# EAGLE design OC2 (EAGLE 7.7.0)
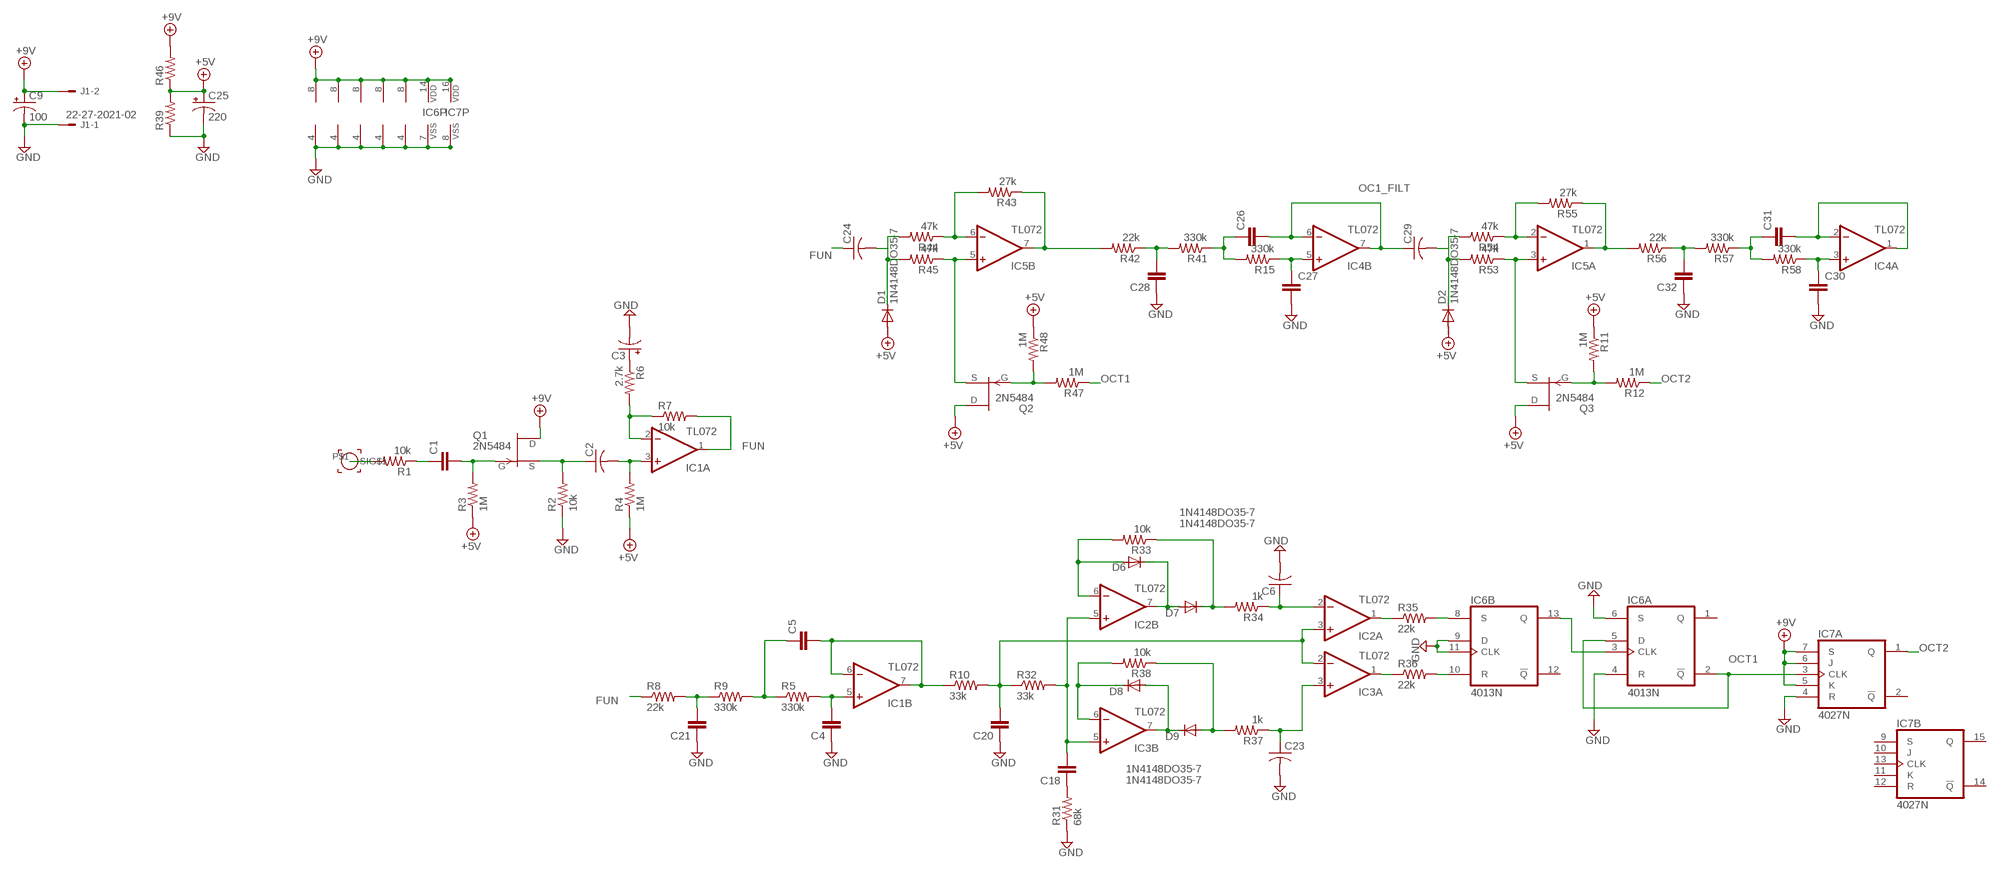
[diagram p0: schematic, sheet 1]

## Parts
C1  C-EU  [C025-025X050-BP]
C2  C-US  [C050-024X044-BP]
C3  CPOL-USE2.5-5  [E2,5-5]
C4  C-EU  [C025-025X050-BP]
C5  C-EU  [C025-025X050-BP]
C6  C-US  [C050-024X044-BP]
C9  100  CPOL-USE2.5-6  [E2,5-6]
C18  C-EU  [C025-025X050-BP]
C20  C-EU  [C025-025X050-BP]
C21  C-EU  [C025-025X050-BP]
C23  C-US  [C050-024X044-BP]
C24  C-US  [C050-024X044-BP]
C25  220  CPOL-USE3.5-8  [E3,5-8]
C26  C-EU  [C025-025X050-BP]
C27  C-EU  [C025-025X050-BP]
C28  C-EU  [C025-025X050-BP]
C29  C-US  [C050-024X044-BP]
C30  C-EU  [C025-025X050-BP]
C31  C-EU  [C025-025X050-BP]
C32  C-EU  [C025-025X050-BP]
D1  1N4148DO35-7  [DO35-7]
D2  1N4148DO35-7  [DO35-7]
D6  1N4148DO35-7  [DO35-7]
D7  1N4148DO35-7  [DO35-7]
D8  1N4148DO35-7  [DO35-7]
D9  1N4148DO35-7  [DO35-7]
IC1  TL072  [DIL08-BP]
IC2  TL072  [DIL08-BP]
IC3  TL072  [DIL08-BP]
IC4  TL072  [DIL08-BP]
IC5  TL072  [DIL08-BP]
IC6  4013N  [DIL14]
IC7  4027N  [DIL16]
INPUT  SIGNAL_PAD  [SIGNAL_PAD]
J1  22-27-2021-02  [6410-02]
Q1  2N5484  [TO92-]
Q2  2N5484  [TO92-]
Q3  2N5484  [TO92-]
R1  10k  R-US_  [0204V-BP]
R2  10k  R-US_  [0204V-BP]
R3  1M  R-US_  [0204V-BP]
R4  1M  R-US_  [0204V-BP]
R5  330k  R-US_  [0204V-BP]
R6  2.7k  R-US_  [0204V-BP]
R7  10k  R-US_  [0204V-BP]
R8  22k  R-US_0204/2V  [0204V]
R9  330k  R-US_0204/5  [0204/5]
R10  33k  R-US_  [0204V-BP]
R11  1M  R-US_  [0204V-BP]
R12  1M  R-US_  [0204V-BP]
R15  330k  R-US_  [0204V-BP]
R31  68k  R-US_  [0204V-BP]
R32  33k  R-US_  [0204V-BP]
R33  10k  R-US_  [0204V-BP]
R34  1k  R-US_  [0204V-BP]
R35  22k  R-US_  [0204V-BP]
R36  22k  R-US_0204/5  [0204/5]
R37  1k  R-US_  [0204V-BP]
R38  10k  R-US_  [0204V-BP]
R39  R-US_  [0204V-BP]
R41  330k  R-US_  [0204V-BP]
R42  22k  R-US_  [0204V-BP]
R43  27k  R-US_  [0204V-BP]
R44  47k  R-US_  [0204V-BP]
R45  47k  R-US_  [0204V-BP]
R46  R-US_  [0204V-BP]
R47  1M  R-US_  [0204V-BP]
R48  1M  R-US_  [0204V-BP]
R53  47k  R-US_  [0204V-BP]
R54  47k  R-US_  [0204V-BP]
R55  27k  R-US_  [0204V-BP]
R56  22k  R-US_  [0204V-BP]
R57  330k  R-US_  [0204V-BP]
R58  330k  R-US_  [0204V-BP]

## Nets
+5V: C25.+ D1.A D2.A Q2.3(D) Q3.3(D) R3.1 R4.1 R11.1 R39.2 R46.1 R48.1
+9V: C9.+ IC1.8(P:V+) IC2.8(P:V+) IC3.8(P:V+) IC4.8(P:V+) IC5.8(P:V+) IC6.14(P:VDD) IC7.5(A:K) IC7.6(A:J) IC7.7(A:S) IC7.16(P:VDD) J1.2 Q1.3(D) R46.2
FUN: C24.1 IC1.1(A:OUT) R7.2 R8.1
GND: C3.- C4.1 C6.2 C9.- C20.1 C21.1 C23.2 C25.- C27.2 C28.1 C30.2 C32.1 IC1.4(P:V-) IC2.4(P:V-) IC3.4(P:V-) IC4.4(P:V-) IC5.4(P:V-) IC6.4(A:R) IC6.6(A:S) IC6.7(P:VSS) IC6.9(B:D) IC6.11(B:CLK) IC7.4(A:R) IC7.8(P:VSS) J1.1 R2.1 R31.1 R39.1
N$1: IC1.2(A:-IN) R6.2 R7.1
N$2: C3.+ R6.1
N$3: Q2.1(G) R47.2 R48.2
N$4: C2.1 Q1.2(S) R2.2
N$5: C2.2 IC1.3(A:+IN) R4.2
N$6: IC6.8(B:S) R35.2
N$7: IC2.1(A:OUT) R35.1
N$8: IC3.1(A:OUT) R36.1
N$9: IC6.10(B:R) R36.2
N$10: INPUT.P$1(SIG$1) R1.2
N$11: IC6.3(A:CLK) IC6.13(B:Q)
N$12: IC5.5(B:+IN) Q2.2(S) R45.1
N$13: C1.1 R1.1
N$14: C1.2 Q1.1(G) R3.2
N$15: C21.2 R8.2 R9.1
N$16: C5.1 R5.1 R9.2
N$17: C4.2 IC1.5(B:+IN) R5.2
N$18: C5.2 IC1.6(B:-IN) IC1.7(B:OUT) R10.1
N$19: C20.2 IC2.3(A:+IN) IC3.2(A:-IN) R10.2 R32.1
N$20: C18.2 IC2.5(B:+IN) IC3.5(B:+IN) R32.2
N$21: C18.1 R31.2
N$22: D8.C IC3.6(B:-IN) R38.2
N$23: D8.A D9.C IC3.7(B:OUT)
N$24: D6.C D7.A IC2.7(B:OUT)
N$25: D6.A IC2.6(B:-IN) R33.2
N$26: C6.1 IC2.2(A:-IN) R34.1
N$27: D9.A R37.2 R38.1
N$28: C23.1 IC3.3(A:+IN) R37.1
N$29: D7.C R33.1 R34.2
N$30: Q3.1(G) R11.2 R12.2
N$31: IC5.3(A:+IN) Q3.2(S) R53.1
N$32: C24.2 D1.C R44.2 R45.2
N$33: C29.2 D2.C R53.2 R54.2
N$34: IC5.6(B:-IN) R43.2 R44.1
N$35: IC5.2(A:-IN) R54.1 R55.2
N$37: IC5.1(A:OUT) R55.1 R56.2
N$38: IC5.7(B:OUT) R42.2 R43.1
N$39: C30.1 IC4.3(A:+IN) R58.1
N$40: C27.1 IC4.5(B:+IN) R15.1
N$41: C26.1 R15.2 R41.1
N$42: C28.2 R41.2 R42.1
N$43: C31.1 R57.1 R58.2
N$44: C32.2 R56.1 R57.2
OC1_FILT: C26.2 C29.1 IC4.6(B:-IN) IC4.7(B:OUT)
OC1_FILT2: C31.2 IC4.1(A:OUT) IC4.2(A:-IN)
OCT1: IC6.2(A:!Q) IC6.5(A:D) IC7.3(A:CLK) R47.1
OCT2: IC7.1(A:Q) R12.1
Unconnected: IC6.1(A:Q) IC6.12(B:!Q) IC7.2(A:!Q) IC7.9(B:S) IC7.10(B:J) IC7.11(B:K) IC7.12(B:R) IC7.13(B:CLK) IC7.14(B:!Q) IC7.15(B:Q)

## Library data of the parts
C1 C4 C5 C18 C20 C21 C26-C28 C30-C32 = rcl:C-EU: CAPACITOR, European symbol
C2 C6 C23 C24 C29 = rcl:C-US: CAPACITOR, American symbol
C3 C9 C25 = rcl:CPOL-US: POLARIZED CAPACITOR, American symbol
D1 D2 D6-D9 = diode:1N4148: DIODE high speed (Philips)
IC1-IC5 = linear:TL072: OP AMP
IC6 = 40xx:4013: Dual D FLIP FLOP, set/reset
IC7 = 40xx:4027: Dual JK FLIP FLOP
INPUT = SignalPad:SIGNAL_PAD
J1 = con-molex:22-?-02: CONNECTOR wire to board 2.54 mm (.1 inch) pitch header; OC_FARNELL: unknown; OC_NEWARK: unknown
Q1-Q3 = transistor-fet:?548*: N-Channel JFETs Source: VISHAY 2N5484.pdf Compatible: TO92 2N5245 J304 J305 U310 J308 J309 J310 TO72 2N4416 2N4416A 2N3823 2N4351 3N169 3N170 3N171 MFE3002 TO18 2N3796 2N3797 MFE825 Source: Motorola European Master Guide Pacge 3-59
R1-R12 R15 R31-R39 R41-R48 R53-R58 = rcl:R-US_: RESISTOR, American symbol

## Board
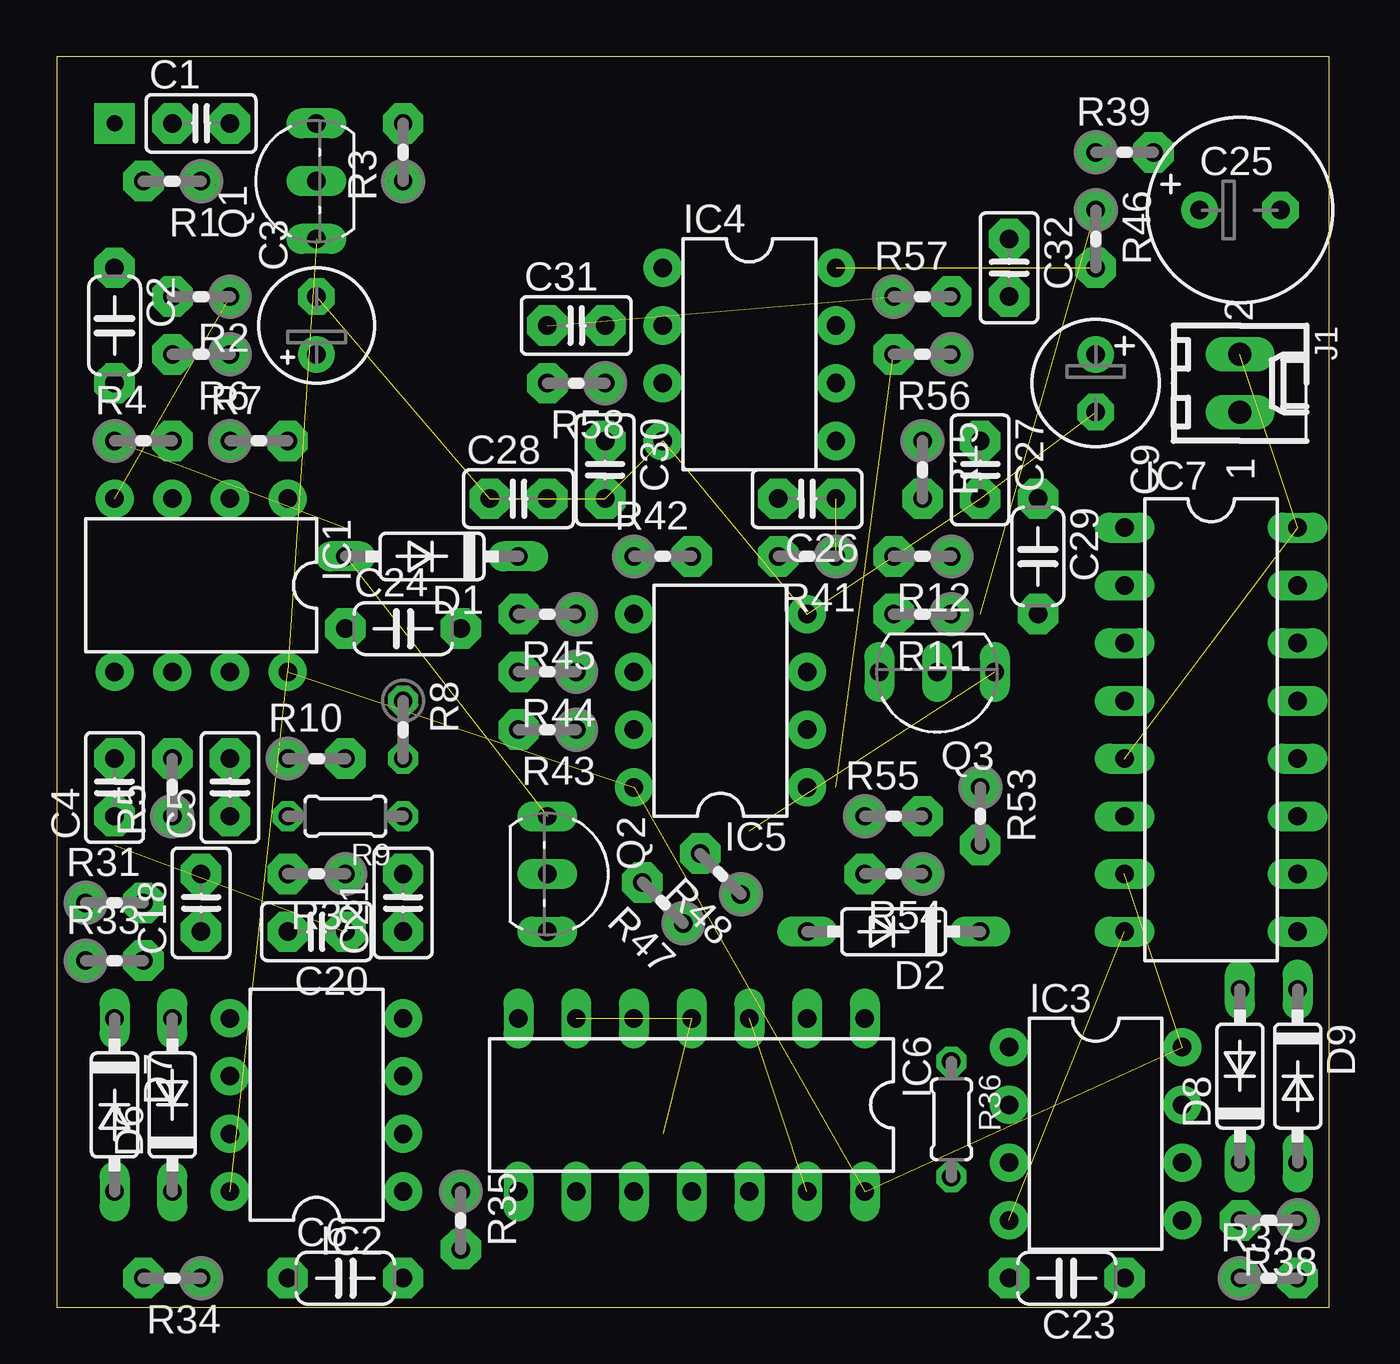
[diagram p1: board, top side]
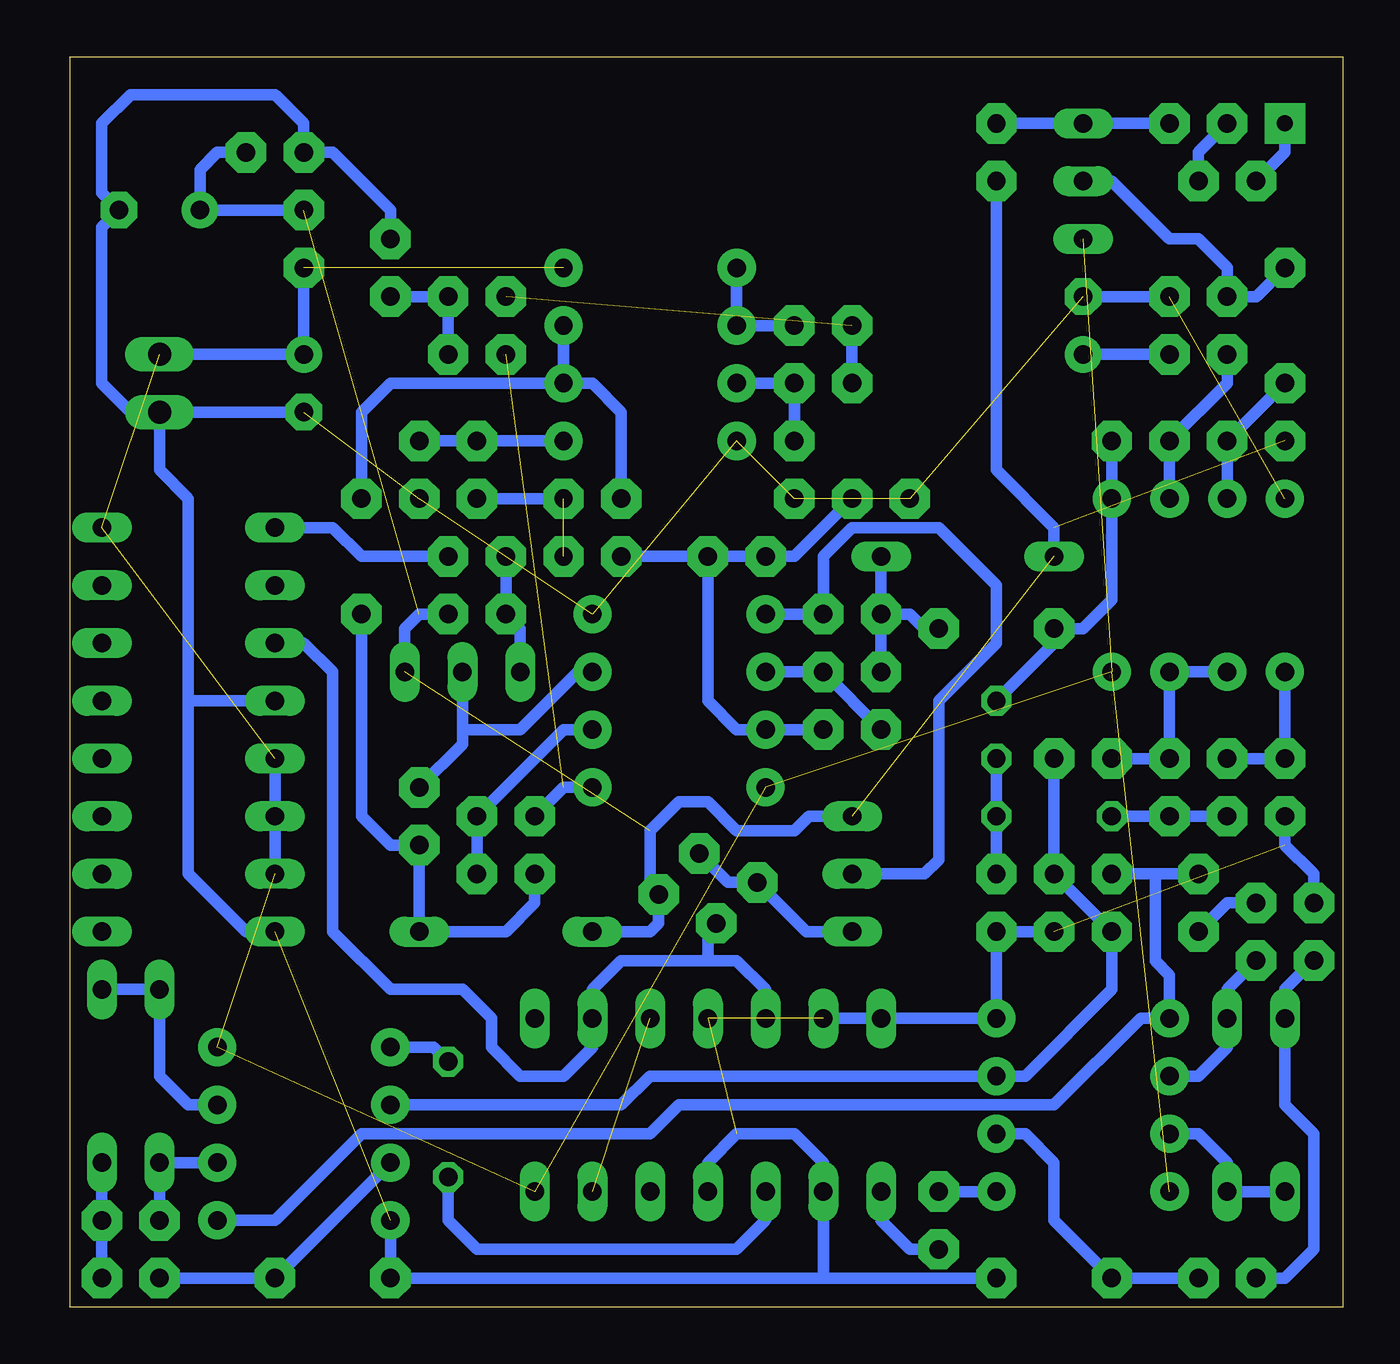
[diagram p2: board, bottom side, seen from below]

Size 56 x 55 mm. Coordinates in mm from the lower left corner, seen from the top.
Outline: 0,0 56,0 56,55 0,55 0,0
Copper layers (1*16): Top 0.035mm / dielectric 1.5mm / Bottom 0.035mm
Design rules "default": minimum track width 10mil, minimum drill 24mil, track to track 8mil, track to pad 8mil, pad to pad 8mil, via to via 8mil, smd to smd 8mil, copper to edge 40mil, drill to drill 8mil, minimum pad ring 10mil, minimum via ring 8mil, stop-mask expansion 4mil, vias tented up to drill 0mil, thermal gap 10mil

### Footprints (pad centres in the part's own frame; a part is rotated, then mirrored left to right if it is on the bottom)
C025-025X050-BP = drill 0.813 pad 1.778 octagon: 1 -1.27,0; 2 1.27,0
C050-024X044-BP = drill 0.813 pad 1.778 octagon: 1 -2.54,0; 2 2.54,0
E2,5-5 = drill 0.813 pad 1.6: + -1.27,0 | drill 0.813 pad 1.6 octagon: - 1.27,0
E2,5-6 = drill 0.813 pad 1.6: + -1.27,0 | drill 0.813 pad 1.6 octagon: - 1.27,0
E3,5-8 = drill 0.813 pad 1.6: + -1.778,0 | drill 0.813 pad 1.6 octagon: - 1.778,0
DO35-7 = drill 0.813 long: A 3.81,0; C -3.81,0
DIL08-BP = drill 0.813 pad 1.676: 1 -3.81,-3.81; 2 -1.27,-3.81; 3 1.27,-3.81; 4 3.81,-3.81; 5 3.81,3.81; 6 1.27,3.81; 7 -1.27,3.81; 8 -3.81,3.81
DIL14 = drill 0.813 long: 1 -7.62,-3.81; 2 -5.08,-3.81; 3 -2.54,-3.81; 4 0,-3.81; 5 2.54,-3.81; 6 5.08,-3.81; 7 7.62,-3.81; 8 7.62,3.81; 9 5.08,3.81; 10 2.54,3.81; 11 0,3.81; 12 -2.54,3.81; 13 -5.08,3.81; 14 -7.62,3.81
DIL16 = drill 0.813 long: 1 -8.89,-3.81; 2 -6.35,-3.81; 3 -3.81,-3.81; 4 -1.27,-3.81; 5 1.27,-3.81; 6 3.81,-3.81; 7 6.35,-3.81; 8 8.89,-3.81; 9 8.89,3.81; 10 6.35,3.81; 11 3.81,3.81; 12 1.27,3.81; 13 -1.27,3.81; 14 -3.81,3.81; 15 -6.35,3.81; 16 -8.89,3.81
SIGNAL_PAD = drill 0.7 pad 1.778 square: P$1 0,0
6410-02 = drill 1.016 long: 1 1.27,0; 2 -1.27,0
TO92- = drill 0.813 long: 1 2.54,0; 2 0,0; 3 -2.54,0
0204V-BP = drill 0.813 pad 1.778 octagon: 1 -1.27,0; 2 1.27,0
0204V = drill 0.813 octagon: 1 -1.27,0; 2 1.27,0
0204/5 = drill 0.813 octagon: 1 -2.54,0; 2 2.54,0

### Placement (x,y rotation side)
C1  6.35,52.07 0 top
C2  2.54,43.18 270 top
C3  11.43,43.18 90 top
C4  2.54,22.86 90 top
C5  7.62,22.86 90 top
C6  12.7,1.27 0 top
C9  45.72,40.64 270 top
C18  6.35,17.78 90 top
C20  11.43,16.51 180 top
C21  15.24,17.78 90 top
C23  44.45,1.27 180 top
C24  15.24,29.84 0 top
C25  52.07,48.26 0 top
C26  33.02,35.56 180 top
C27  40.64,36.83 270 top
C28  20.32,35.56 0 top
C29  43.18,33.02 270 top
C30  24.13,36.83 270 top
C31  22.86,43.18 0 top
C32  41.91,45.72 270 top
D1  16.51,33.02 180 top
D2  36.83,16.51 180 top
D6  5.08,8.89 90 top
D7  2.54,8.89 270 top
D8  52.07,10.16 90 top
D9  54.61,10.16 270 top
IC1  6.35,31.75 180 top
IC2  11.43,8.89 90 top
IC3  45.72,7.62 270 top
IC4  30.48,41.91 270 top
IC5  29.21,26.67 90 top
IC6  27.94,8.89 180 top
IC7  50.8,25.4 270 top
INPUT  2.54,52.07 0 top
J1  52.07,40.64 270 top
Q1  11.43,49.53 90 top
Q2  21.59,19.05 270 top
Q3  38.73,27.94 180 top
R1  5.08,49.53 180 top
R2  6.35,44.45 180 top
R3  15.24,50.8 90 top
R4  3.81,38.1 0 top
R5  5.08,22.86 90 top
R6  6.35,41.91 180 top
R7  8.89,38.1 0 top
R8  15.24,25.4 270 top
R9  12.7,21.59 180 top
R10  11.43,24.13 0 top
R11  38.1,30.48 180 top
R12  38.1,33.02 180 top
R15  38.1,36.83 270 top
R31  2.54,17.78 0 top
R32  11.43,19.05 180 top
R33  2.54,15.24 0 top
R34  5.08,1.27 180 top
R35  17.78,3.81 270 top
R36  39.37,8.26 270 top
R37  53.34,1.27 0 top
R38  53.34,3.81 180 top
R39  46.99,50.8 0 top
R41  33.02,33.02 180 top
R42  26.67,33.02 0 top
R43  21.59,25.4 180 top
R44  21.59,27.94 180 top
R45  21.59,30.48 180 top
R46  45.72,46.99 270 top
R47  26.67,17.78 135 top
R48  29.21,19.05 135 top
R53  40.64,21.59 270 top
R54  36.83,19.05 180 top
R55  36.83,21.59 0 top
R56  38.1,41.91 180 top
R57  38.1,44.45 0 top
R58  22.86,40.64 180 top

### Tracks (layer width: path | path; a pad name or v marks a point on that pad's centre or on a via)
+5V  (4 unrouted)
  Bottom 0.508: R11.1 40.64,30.48 41.27,29.84 Q3.3 | R46.1 C25.+ 50.29,50.04 49.53,50.8 R39.2 | R3.1 15.24,36.83 12.7,34.29 D1.A | D2.A 30.48,16.51 30.11,16.88 R48.1 30.48,18.52 30.48,20.95 29.21,22.23 27.94,22.23 26.67,20.95 24.13,20.95 23.5,21.59 Q2.3
+9V  (9 unrouted)
  Bottom 0.508: J1.2 C9.+ R46.2 | IC7.7 IC7.6 IC7.5
FUN
  Bottom 0.508: R7.2 IC1.1 10.16,31.11 11.43,29.84 C24.1 12.7,29.21 R8.1
GND  (11 unrouted)
  Bottom 0.508: J1.1 53.34,39.37 54.61,40.64 54.61,47.5 C25.- 54.61,49.02 54.61,52.07 53.34,53.34 46.99,53.34 45.72,52.07 R39.1 44.45,50.8 41.91,48.26 C32.1 | C9.- J1.1 | IC7.8 48.26,16.51 50.8,19.05 50.8,26.67 | 49.53,26.67 IC7.4 50.8,26.67 | 50.8,26.67 50.8,35.56 52.07,36.83 J1.1 | IC3.4 C23.2 22.86,1.27 | IC6.11 27.94,6.35 26.67,7.62 24.13,7.62 22.86,6.35 IC6.9 22.86,1.27 | C6.2 22.86,1.27 | IC6.6 IC6.7 IC2.4 C21.1 C20.1 | R31.1 1.27,19.05 2.54,20.32 C4.1 | C3.- R2.1
N$1
  Bottom 0.508: R6.2 5.08,40.64 R7.1 IC1.2
N$2
  Bottom 0.508: R6.1 C3.+
N$3
  Bottom 0.508: R48.2 27.04,18.68 R47.2 23.6,16.51 Q2.1
N$4
  Bottom 0.508: C2.1 3.81,44.45 R2.2 5.08,45.72 6.35,46.99 7.62,46.99 10.16,49.53 Q1.2
N$5
  Bottom 0.508: C2.2 R4.2 IC1.3
N$6
  Bottom 0.508: IC6.8 20.32,3.81 19.05,2.54 R35.2
N$7
  Bottom 0.508: IC2.1 R35.1
N$8
  Bottom 0.508: R36.1 40.01,11.43 IC3.1
N$9
  Bottom 0.508: R36.2 39.37,3.81 38.1,2.54 26.67,2.54 25.4,3.81 IC6.10
N$10
  Bottom 0.508: R1.2 2.54,50.8 INPUT.P$1
N$11  (1 unrouted)
N$12
  Bottom 0.508: IC5.5 R45.1 22.86,33.02 21.59,34.29 17.78,34.29 15.24,31.75 15.24,29.21 17.78,26.67 17.78,19.68 18.41,19.05 Q2.2
N$13
  Bottom 0.508: R1.1 6.35,50.8 C1.1
N$14
  Bottom 0.508: C1.2 Q1.1 R3.2
N$15
  Bottom 0.508: R8.2 R9.1 C21.2
N$16
  Bottom 0.508: R5.1 C5.1 R9.2
N$17
  Bottom 0.508: R5.2 C4.2 IC1.5
N$18
  Bottom 0.508: R10.1 C5.2 IC1.7 IC1.6
N$19
  Bottom 0.508: R10.2 R32.1 C20.2 10.16,13.97 13.97,10.16 IC2.3 30.48,10.16 31.75,8.89 IC3.2
N$20
  Bottom 0.508: C18.2 8.26,19.05 | 8.26,19.05 R32.2 | 8.26,19.05 8.26,15.24 7.62,14.61 IC2.5 8.89,12.7 12.7,8.89 29.21,8.89 30.48,7.62 43.18,7.62 46.99,3.81 IC3.5
N$21
  Bottom 0.508: R31.2 5.08,17.78 C18.1
N$22
  Bottom 0.508: R38.2 D8.C IC3.6
N$23
  Bottom 0.508: D9.C D8.A 52.07,10.16 50.8,8.89 IC3.7
N$24
  Bottom 0.508: IC2.7 6.35,7.62 5.08,6.35 D6.C D7.A
N$25
  Bottom 0.508: R33.2 5.08,13.97 D6.A 5.08,11.43 6.35,10.16 IC2.6
N$26
  Bottom 0.508: R34.1 C6.1 12.7,3.81 12.7,6.35 13.97,7.62 IC2.2
N$27
  Bottom 0.508: R37.2 R38.1 D9.A
N$28
  Bottom 0.508: R37.1 C23.1 IC3.3
N$29
  Bottom 0.508: R33.1 2.54,13.97 D7.C 2.54,8.89 1.27,7.62 1.27,2.54 2.54,1.27 R34.2
N$30
  Bottom 0.508: Q3.1 36.2,29.84 R11.2 R12.2
N$31
  Bottom 0.508: Q3.2 38.73,25.4 | 38.73,25.4 38.73,24.77 R53.1 | IC5.3 33.66,27.94 36.2,25.4 38.73,25.4
N$32
  Bottom 0.508: R44.2 R45.2 | R45.2 D1.C | C24.2 18.41,29.84 19.05,30.48 R45.2
N$33
  Bottom 0.508: C29.2 43.18,21.59 41.91,20.32 R53.2 D2.C 36.83,16.51 35.56,17.78 R54.2
N$34
  Bottom 0.508: IC5.6 R44.1 R43.2
N$35
  Bottom 0.508: R54.1 R55.2 34.29,25.4 IC5.2
N$37  (1 unrouted)
  Bottom 0.508: R55.1 34.29,22.86 IC5.1
N$38
  Bottom 0.508: R42.2 27.94,26.67 26.67,25.4 IC5.7 R43.1
N$39
  Bottom 0.508: IC4.3 R58.1 C30.1
N$40
  Bottom 0.508: IC4.5 R15.1 C27.1
N$41  (1 unrouted)
  Bottom 0.508: C26.1 R15.2
N$42
  Bottom 0.508: R41.2 R42.1 24.13,33.02 C28.2
N$43  (1 unrouted)
  Bottom 0.508: R58.2 C31.1
N$44
  Bottom 0.508: R56.1 R57.2 C32.2
OC1_FILT
  Bottom 0.508: C26.2 31.75,39.37 33.02,40.64 IC4.6 | IC4.6 IC4.7 | C29.1 43.18,39.37 41.91,40.64 IC4.6
OC1_FILT2
  Bottom 0.508: C31.2 IC4.2 IC4.1
OCT1
  Bottom 0.508: IC7.3 45.72,29.21 44.45,27.94 44.45,16.51 41.91,13.97 38.73,13.97 37.47,12.7 37.47,11.43 36.2,10.16 34.29,10.16 33.02,11.43 IC6.2 33.02,13.97 31.75,15.24 27.94,15.24 | 27.94,15.24 26.67,15.24 25.4,13.97 IC6.5 | 27.94,15.24 27.94,16.51 R47.1
OCT2
  Bottom 0.508: R12.1 43.18,33.02 44.45,34.29 IC7.1